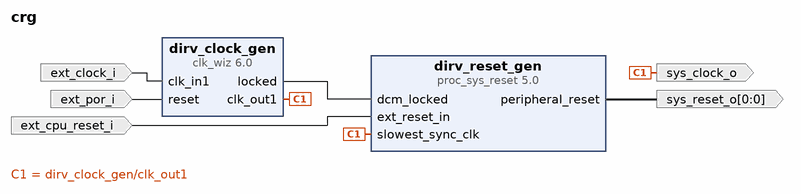
[diagram p0: block diagram of the top level]
# Vivado block design crg, xc7a35ticsg324-1L, Vivado 2018.3
create_bd_design crg

create_bd_port -dir O -from 0 -to 0 -type rst sys_reset_o
create_bd_port -dir I -type rst ext_cpu_reset_i
create_bd_port -dir O -type clk sys_clock_o
set_property -dict {CONFIG.ASSOCIATED_RESET sys_reset_o} [get_bd_ports sys_clock_o]
create_bd_port -dir I -type clk ext_clock_i
set_property -dict [list \
  CONFIG.ASSOCIATED_RESET ext_por_i:ext_cpu_reset_i \
  CONFIG.CLK_DOMAIN crg_ext_clk_i \
  CONFIG.FREQ_HZ 100000000 \
] [get_bd_ports ext_clock_i]
create_bd_port -dir I -type rst ext_por_i
set_property -dict {CONFIG.POLARITY ACTIVE_HIGH} [get_bd_ports ext_por_i]

create_bd_cell -type ip -vlnv xilinx.com:ip:clk_wiz:6.0 dirv_clock_gen
set_property -dict [list \
  CONFIG.CLKOUT1_JITTER 151.636 \
  CONFIG.CLKOUT1_PHASE_ERROR 98.575 \
  CONFIG.CLKOUT1_REQUESTED_OUT_FREQ 50.000 \
  CONFIG.MMCM_CLKFBOUT_MULT_F 10.000 \
  CONFIG.MMCM_CLKOUT0_DIVIDE_F 20.000 \
  CONFIG.MMCM_DIVCLK_DIVIDE 1 \
] [get_bd_cells dirv_clock_gen]
create_bd_cell -type ip -vlnv xilinx.com:ip:proc_sys_reset:5.0 dirv_reset_gen

# ---- connections ----

connect_bd_net -net clk_wiz_0_clk_out1 [get_bd_pins dirv_clock_gen/clk_out1] [get_bd_pins dirv_reset_gen/slowest_sync_clk] [get_bd_ports sys_clock_o]
connect_bd_net -net clk_wiz_0_locked [get_bd_pins dirv_clock_gen/locked] [get_bd_pins dirv_reset_gen/dcm_locked]
connect_bd_net -net proc_sys_reset_0_peripheral_reset [get_bd_pins dirv_reset_gen/peripheral_reset] [get_bd_ports sys_reset_o]
connect_bd_net -net ext_reset_i_1 [get_bd_ports ext_cpu_reset_i] [get_bd_pins dirv_reset_gen/ext_reset_in]
connect_bd_net [get_bd_ports ext_clock_i] [get_bd_pins dirv_clock_gen/clk_in1]
connect_bd_net -net ext_reset_i_2 [get_bd_ports ext_por_i] [get_bd_pins dirv_clock_gen/reset]

validate_bd_design
save_bd_design
